# Altium schematic sheet PCB_main.SchDoc
size A4
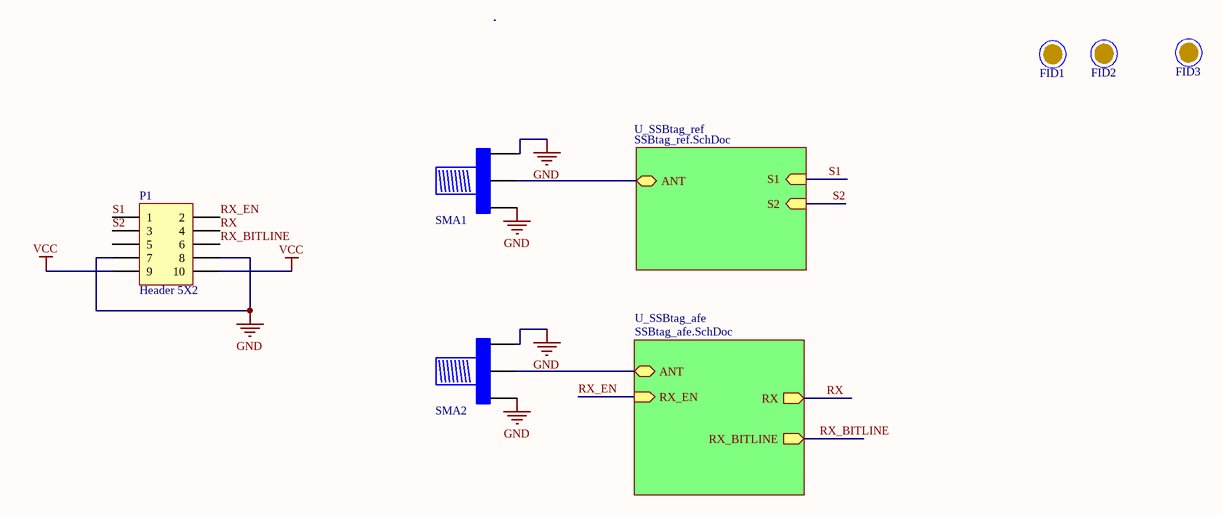
[diagram p0: PCB_main.SchDoc]

## Parts
FID1  Fiducial  [Fiducial10-20]  (value not drawn)
FID2  Fiducial  [Fiducial10-20]  (value not drawn)
FID3  Fiducial  [Fiducial10-20]  (value not drawn)
P1  Header 5X2  [HDR2X5]
SMA1  SMA - Edge  [SMA - Edge - Wide]  (value not drawn)
SMA2  SMA - Edge  [SMA - Edge - Wide]  (value not drawn)

## Sub-sheets
U_SSBtag_afe = SSBtag_afe.SchDoc: ANT (bidir), RX_EN (in), RX (out), RX_BITLINE (out)
U_SSBtag_ref = SSBtag_ref.SchDoc: ANT (bidir), S1 (in), S2 (in)

## Nets
GND: P1.7 P1.8 SMA1.1 SMA2.1
VCC: P1.9 P1.10
RX: P1.4 ; sheet U_SSBtag_afe/RX
RX_BITLINE: P1.6 ; sheet U_SSBtag_afe/RX_BITLINE
RX_EN: P1.2 ; sheet U_SSBtag_afe/RX_EN
S1: P1.1 ; sheet U_SSBtag_ref/S1
S2: P1.3 ; sheet U_SSBtag_ref/S2
NetSMA1_2: SMA1.2 ; sheet U_SSBtag_ref/ANT
NetSMA2_2: SMA2.2 ; sheet U_SSBtag_afe/ANT

Not connected (* = marked no-connect by the designer): P1 5

## Library data of the parts
FID1-FID3 = FID
P1 = Header 5X2: Header, 5-Pin, Dual row; LatestRevisionDate: 17-Jul-2002; LatestRevisionNote: Re-released for DXP Platform.; Publisher: Altium Limited
SMA1 SMA2 = SMA - Edge: SMA - Board Edge Connector; Note: *; Digi-Key Part Number: *; Manufacturer Part Number: *; Manufacturer: *